# Altium schematic sheet A3_plants.SchDoc
size 365 x 198 mm; SheetNumber: 3; SheetTotal: 6
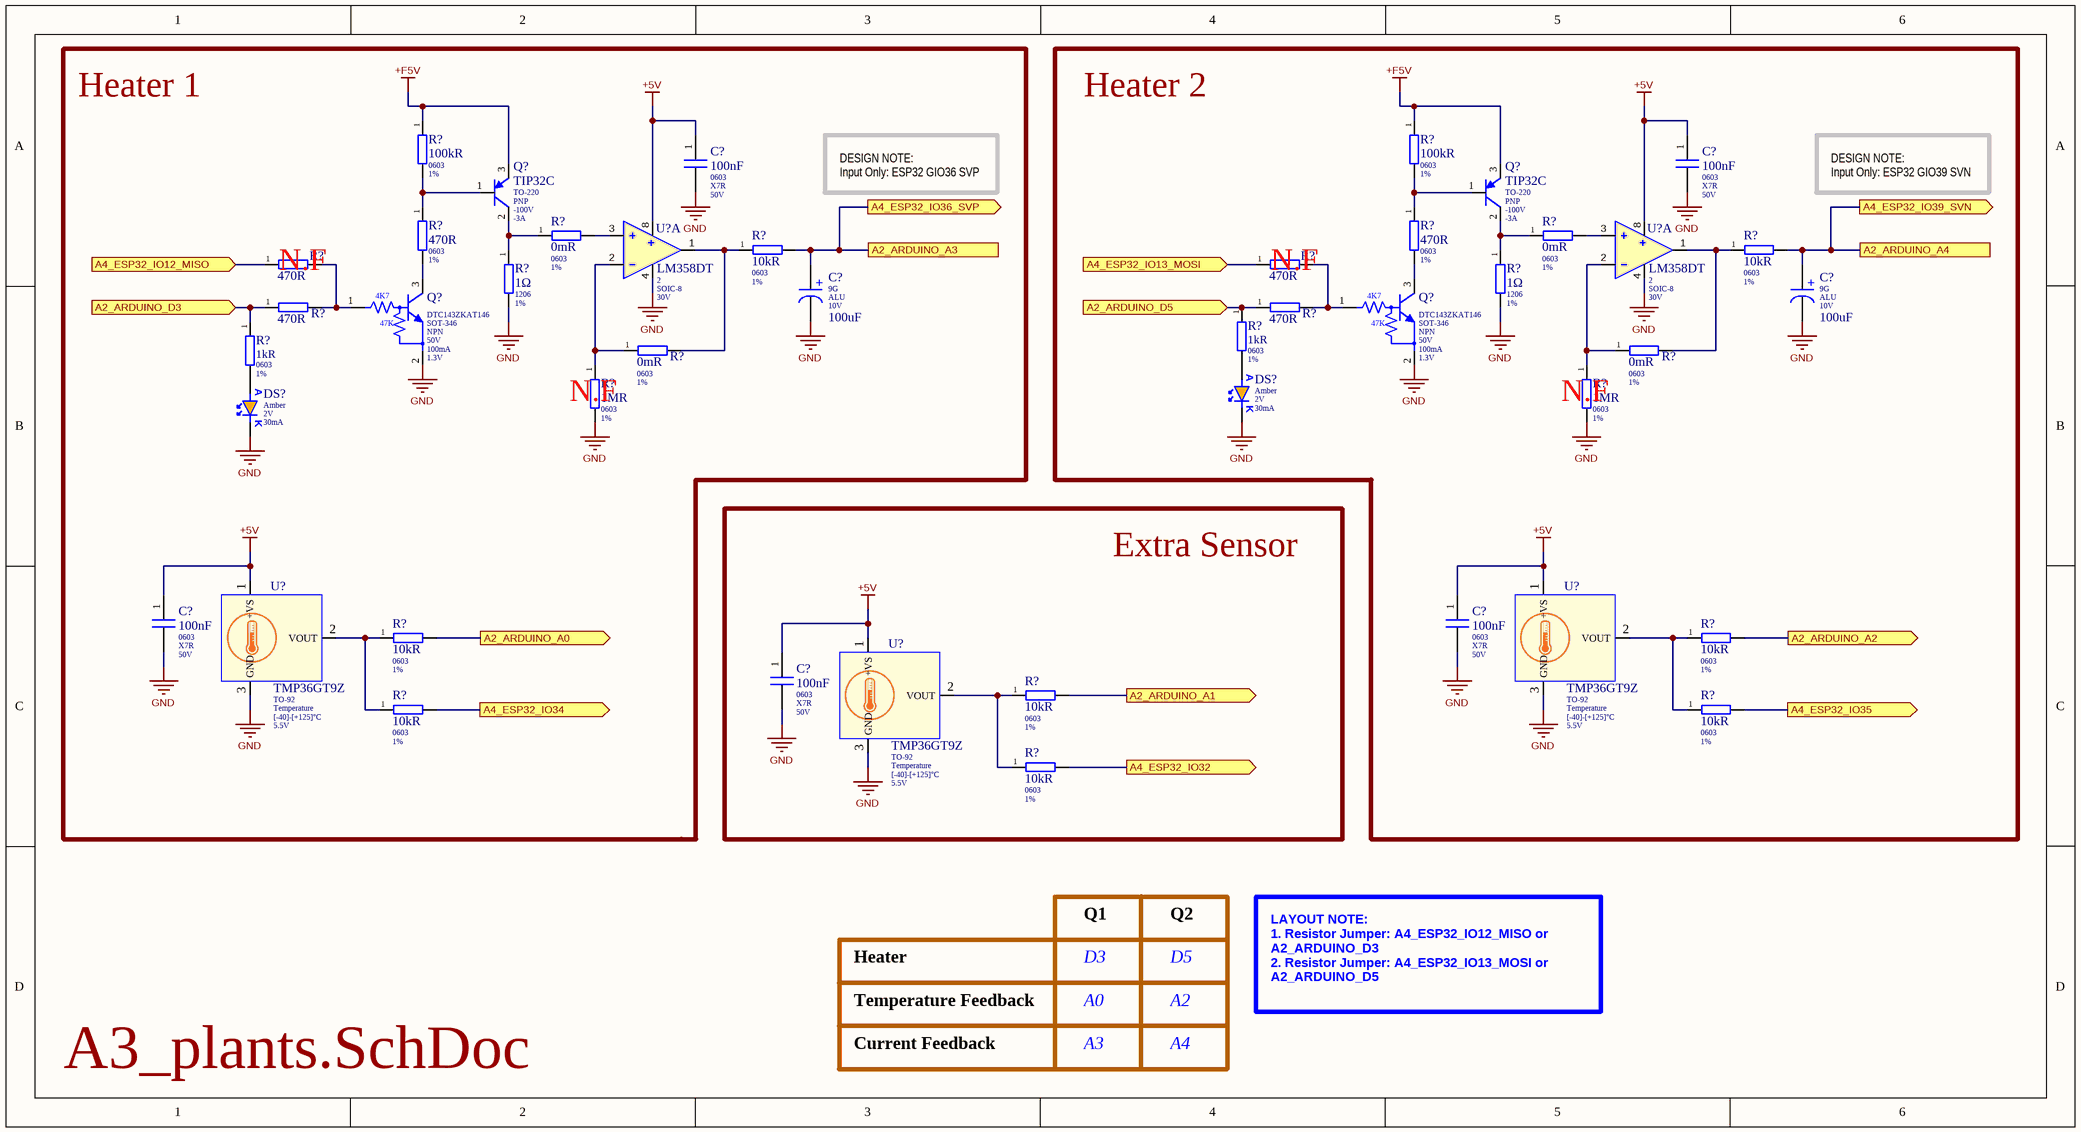
[diagram p0: A3_plants.SchDoc]

## Parts
(Parts that share a designator on the sheet are numbered #1, #2 ... from top to bottom, then left to right.)
C?#1  Capacitance: 100nF  Case/Package: 0603  Dielectric: X7R  Voltage Rating (DC): 50V  [CAPC1608X09N]  (hidden comment: CAP-CER_100n_50V_20%_X7R_0603)
C?#2  Capacitance: 100nF  Case/Package: 0603  Dielectric: X7R  Voltage Rating (DC): 50V  [CAPC1608X09N]  (hidden comment: CAP-CER_100n_50V_20%_X7R_0603)
C?#3  _Case Size: 9G  _Type: ALU  Voltage Rating: 10V  Capacitance: 100uF  [CAPAE7866X56M]  (hidden comment: CAP-ALU_100uF_10V_20%_9G/SMD)
C?#4  _Case Size: 9G  _Type: ALU  Voltage Rating: 10V  Capacitance: 100uF  [CAPAE7866X56M]  (hidden comment: CAP-ALU_100uF_10V_20%_9G/SMD)
C?#5  Capacitance: 100nF  Case/Package: 0603  Dielectric: X7R  Voltage Rating (DC): 50V  [CAPC1608X09N]  (hidden comment: CAP-CER_100n_50V_20%_X7R_0603)
C?#6  Capacitance: 100nF  Case/Package: 0603  Dielectric: X7R  Voltage Rating (DC): 50V  [CAPC1608X09N]  (hidden comment: CAP-CER_100n_50V_20%_X7R_0603)
C?#7  Capacitance: 100nF  Case/Package: 0603  Dielectric: X7R  Voltage Rating (DC): 50V  [CAPC1608X09N]  (hidden comment: CAP-CER_100n_50V_20%_X7R_0603)
DS?#1  _Color: Amber  _Forward_Voltage: 2V  _Forward_Current: 30mA  [LEDC1608X08N_A]  (hidden comment: LED_amber_2V_30mA_0603)
DS?#2  _Color: Amber  _Forward_Voltage: 2V  _Forward_Current: 30mA  [LEDC1608X08N_A]  (hidden comment: LED_amber_2V_30mA_0603)
Q?#1  MFG PN: TIP32C  Case/Package: TO-220  Polarity: PNP  Voltage Rating (DC): -100V  Current Rating: -3A  [TO255P1040X460X1968-3P_ST_HS191x132x95]  (hidden comment: TRNS-PNP_(-100V)_3A_TO-220)
Q?#2  MFG PN: TIP32C  Case/Package: TO-220  Polarity: PNP  Voltage Rating (DC): -100V  Current Rating: -3A  [TO255P1040X460X1968-3P_ST_HS191x132x95]  (hidden comment: TRNS-PNP_(-100V)_3A_TO-220)
Q?#3  MFG PN: DTC143ZKAT146  Case/Package: SOT-346  Polarity: NPN  Voltage Rating (DC): 50V  Continuous Collector Current: 100mA  Input Voltage: 1.3V  [ROHM_DTC143ZKAT146]  (hidden comment: DIGTTRAN-NPN_50V_100mA_1.3V_SOT-346)
Q?#4  MFG PN: DTC143ZKAT146  Case/Package: SOT-346  Polarity: NPN  Voltage Rating (DC): 50V  Continuous Collector Current: 100mA  Input Voltage: 1.3V  [ROHM_DTC143ZKAT146]  (hidden comment: DIGTTRAN-NPN_50V_100mA_1.3V_SOT-346)
R?#1  Resistance: 100kR  Case Code (Imperial): 0603  Tolerance: 1%  [RESC1608X06N]  (hidden comment: RES_100K_100mW_1%_0603)
R?#2  Resistance: 100kR  Case Code (Imperial): 0603  Tolerance: 1%  [RESC1608X06N]  (hidden comment: RES_100K_100mW_1%_0603)
R?#3  value 470R  Case/Package: 0603  Tolerance: 1%  [RESC1608X06N]  (hidden comment: RES_470R_100mW_1%_0603)
R?#4  value 470R  Case/Package: 0603  Tolerance: 1%  [RESC1608X06N]  (hidden comment: RES_470R_100mW_1%_0603)
R?#5  Resistance: 0mR  Case/Package: 0603  Tolerance: 1%  [RESC1608X06N]  (hidden comment: RES_0R_100mW_1%_0603)
R?#6  Resistance: 0mR  Case/Package: 0603  Tolerance: 1%  [RESC1608X06N]  (hidden comment: RES_0R_100mW_1%_0603)
R?#7  value 1Ω  Case/Package: 1206  Tolerance: 1%  [RESC3216X06N]  (hidden comment: RES_1R_250mW_1%_1206)
R?#8  Resistance: 10kR  Case/Package: 0603  Tolerance: 1%  [RESC1608X06N]  (hidden comment: RES_10K_100mW_1%_0603)
R?#9  value 1Ω  Case/Package: 1206  Tolerance: 1%  [RESC3216X06N]  (hidden comment: RES_1R_250mW_1%_1206)
R?#10  Resistance: 10kR  Case/Package: 0603  Tolerance: 1%  [RESC1608X06N]  (hidden comment: RES_10K_100mW_1%_0603)
R?#11  value 470R  [RESC1608X06N]  (hidden comment: RES_470R_100mW_1%_0603)
R?#12  value 470R  [RESC1608X06N]  (hidden comment: RES_470R_100mW_1%_0603)
R?#13  value 470R  [RESC1608X06N]  (hidden comment: RES_470R_100mW_1%_0603)
R?#14  Resistance: 1kR  Case/Package: 0603  Tolerance: 1%  [RESC1608X06N]  (hidden comment: RES_1K_100mW_1%_0603)
R?#15  value 470R  [RESC1608X06N]  (hidden comment: RES_470R_100mW_1%_0603)
R?#16  Resistance: 1kR  Case/Package: 0603  Tolerance: 1%  [RESC1608X06N]  (hidden comment: RES_1K_100mW_1%_0603)
R?#17  Resistance: 0mR  Case/Package: 0603  Tolerance: 1%  [RESC1608X06N]  (hidden comment: RES_0R_100mW_1%_0603)
R?#18  Resistance: 0mR  Case/Package: 0603  Tolerance: 1%  [RESC1608X06N]  (hidden comment: RES_0R_100mW_1%_0603)
R?#19  value 1MR  Case Code (Imperial): 0603  Tolerance: 1%  [RESC1608X06N]  (hidden comment: RES_1M_100mW_1%_0603)
R?#20  value 1MR  Case Code (Imperial): 0603  Tolerance: 1%  [RESC1608X06N]  (hidden comment: RES_1M_100mW_1%_0603)
R?#21  Resistance: 10kR  Case/Package: 0603  Tolerance: 1%  [RESC1608X06N]  (hidden comment: RES_10K_100mW_1%_0603)
R?#22  Resistance: 10kR  Case/Package: 0603  Tolerance: 1%  [RESC1608X06N]  (hidden comment: RES_10K_100mW_1%_0603)
R?#23  Resistance: 10kR  Case/Package: 0603  Tolerance: 1%  [RESC1608X06N]  (hidden comment: RES_10K_100mW_1%_0603)
R?#24  Resistance: 10kR  Case/Package: 0603  Tolerance: 1%  [RESC1608X06N]  (hidden comment: RES_10K_100mW_1%_0603)
R?#25  Resistance: 10kR  Case/Package: 0603  Tolerance: 1%  [RESC1608X06N]  (hidden comment: RES_10K_100mW_1%_0603)
R?#26  Resistance: 10kR  Case/Package: 0603  Tolerance: 1%  [RESC1608X06N]  (hidden comment: RES_10K_100mW_1%_0603)
U?#1  MFG PN: LM358DT  Number of Circuits: 2  Case/Package: SOIC-8  Max Supply Voltage: 30V  [SOIC127P600X175-8N]  (hidden comment: OPAMP_2_30V_7mV_1.1MHz_SOIC-8)  (part A of 2)
U?#2  MFG PN: LM358DT  Number of Circuits: 2  Case/Package: SOIC-8  Max Supply Voltage: 30V  [SOIC127P600X175-8N]  (hidden comment: OPAMP_2_30V_7mV_1.1MHz_SOIC-8)  (part A of 2)
U?#3  MFG PN: TMP36GT9Z  Case/Package: TO-92  Type: Temperature  Temp. Range: [-40]-[+125]°C  Max Supply Voltage: 5.5V  [XDCR_TMP36GT9]  (hidden comment: XDCR_Temp_(-40)-125C_2.7-5.5V_TO-92)
U?#4  MFG PN: TMP36GT9Z  Case/Package: TO-92  Type: Temperature  Temp. Range: [-40]-[+125]°C  Max Supply Voltage: 5.5V  [XDCR_TMP36GT9]  (hidden comment: XDCR_Temp_(-40)-125C_2.7-5.5V_TO-92)
U?#5  MFG PN: TMP36GT9Z  Case/Package: TO-92  Type: Temperature  Temp. Range: [-40]-[+125]°C  Max Supply Voltage: 5.5V  [XDCR_TMP36GT9]  (hidden comment: XDCR_Temp_(-40)-125C_2.7-5.5V_TO-92)

## Blocks framed on the sheet
Heater 2: C?#2 C?#4 C?#6 DS?#1 Q?#2 Q?#4 R?#2 R?#4 R?#6 R?#9 R?#10 R?#12 R?#14 R?#15 R?#18 R?#20 R?#22 R?#25 U?#2 U?#4
Extra Sensor: C?#7 R?#23 R?#26 U?#5

## Ports
A2_ARDUINO_A0 (out), A2_ARDUINO_A1 (out), A2_ARDUINO_A2 (out), A2_ARDUINO_A3 (out), A2_ARDUINO_A4 (out), A2_ARDUINO_D3 (in), A2_ARDUINO_D5 (in), A4_ESP32_IO12_MISO (in), A4_ESP32_IO13_MOSI (in), A4_ESP32_IO32 (out), A4_ESP32_IO34 (out), A4_ESP32_IO35 (out), A4_ESP32_IO36_SVP (out), A4_ESP32_IO39_SVN (out)

## Nets
+5V: C?#1.1 C?#2.1 C?#5.1 C?#6.1 C?#7.1 U?#1.8(VCC+) U?#2.8(VCC+) U?#3.1(+VS) U?#4.1(+VS) U?#5.1(+VS)
+F5V: Q?#1.3(E) Q?#2.3(E) R?#1.1 R?#2.1
GND: C?#1.2 C?#2.2 C?#3.2(Negative) C?#4.2(Negative) C?#5.2 C?#6.2 C?#7.2 DS?#1.2(K) DS?#2.2(K) Q?#3.2(E) Q?#4.2(E) R?#7.2 R?#9.2 R?#19.2 R?#20.2 U?#1.4(VCC-) U?#2.4(VCC-) U?#3.3(GND) U?#4.3(GND) U?#5.3(GND)
A2_ARDUINO_A0: R?#21.2 ; port A2_ARDUINO_A0
A2_ARDUINO_A1: R?#23.2 ; port A2_ARDUINO_A1
A2_ARDUINO_A2: R?#22.2 ; port A2_ARDUINO_A2
A2_ARDUINO_D3: R?#13.1 R?#16.1 ; port A2_ARDUINO_D3
A2_ARDUINO_D5: R?#14.1 R?#15.1 ; port A2_ARDUINO_D5
A4_ESP32_IO12_MISO: R?#11.1 ; port A4_ESP32_IO12_MISO
A4_ESP32_IO13_MOSI: R?#12.1 ; port A4_ESP32_IO13_MOSI
A4_ESP32_IO32: R?#26.2 ; port A4_ESP32_IO32
A4_ESP32_IO34: R?#24.2 ; port A4_ESP32_IO34
A4_ESP32_IO35: R?#25.2 ; port A4_ESP32_IO35
A4_ESP32_IO36_SVP: C?#3.1(Positive) R?#8.2 ; port A4_ESP32_IO36_SVP
A4_ESP32_IO39_SVN: C?#4.1(Positive) R?#10.2 ; port A4_ESP32_IO39_SVN
NetDS?#1_1: DS?#1.1(A) R?#14.2
NetDS?#2_1: DS?#2.1(A) R?#16.2
NetQ?#1_1: Q?#1.1(B) R?#1.2 R?#3.1
NetQ?#1_2: Q?#1.2(C) R?#5.1 R?#7.1
NetQ?#2_1: Q?#2.1(B) R?#2.2 R?#4.1
NetQ?#2_2: Q?#2.2(C) R?#6.1 R?#9.1
NetQ?#3_1: Q?#3.1(B) R?#11.2 R?#13.2
NetQ?#3_3: Q?#3.3(C) R?#3.2
NetQ?#4_1: Q?#4.1(B) R?#12.2 R?#15.2
NetQ?#4_3: Q?#4.3(C) R?#4.2
NetR?#5_2: R?#5.2 U?#1.3(IN1+)
NetR?#6_2: R?#6.2 U?#2.3(IN1+)
NetR?#8_1: R?#8.1 R?#17.2 U?#1.1(OUT1)
NetR?#10_1: R?#10.1 R?#18.2 U?#2.1(OUT1)
NetR?#17_1: R?#17.1 R?#19.1 U?#1.2(IN1-)
NetR?#18_1: R?#18.1 R?#20.1 U?#2.2(IN1-)
NetR?#21_1: R?#21.1 R?#24.1 U?#3.2(VOUT)
NetR?#22_1: R?#22.1 R?#25.1 U?#4.2(VOUT)
NetR?#23_1: R?#23.1 R?#26.1 U?#5.2(VOUT)

## Notes on the sheet
- Heater 1
- DESIGN NOTE:
  Input Only: ESP32 GIO36 SVP
- DESIGN NOTE:
  Input Only: ESP32 GIO39 SVN
- (near R?#11) N.F
- (near R?#12) N.F
- (near R?#19) N.F
- (near R?#20) N.F
- Q1
- Q2
- Heater
- Temperature Feedback
- D3
- A0
- D5
- A2
- LAYOUT NOTE:
  1. Resistor Jumper: A4_ESP32_IO12_MISO or A2_ARDUINO_D3
  2. Resistor Jumper: A4_ESP32_IO13_MOSI or A2_ARDUINO_D5
- Current Feedback
- A3
- A4
- (in symbol Kemet_EDK107M010A9GAA) +
- (in symbol ROHM_DTC143ZKAT146) 4K7; 47K

## Library data of the parts
C?#1 C?#2 C?#5-C?#7 = Kemet_C0603C104M5RAC: MFG: KEMET; Dielectric Material: Ceramic; Tolerance: 20%; _Checked_PCB: HoP; Supplier 1: Mouser; MFG PN: C0603C104M5RAC; RoHS: Yes; Category: Ceramic Capacitors; Stock 1: 461921; Pricing 1: 1=0.1, 10=0.033, 50=0.033, 100=0.015, 1000=0.009, 10000=0.006 (USD); Mount: Surface Mount; Case Code (Imperial): 0603; Case Code (Metric): 1608; Min Operating Temperature: -55°C; Max Operating Temperature: 125°C; Packaging: Tape and Reel; Package Quantity: 4000; Termination: SMD/SMT; Series: C0603C; Construction: Flat; Length: 1.6mm; Width: 0.8mm; RoHS Compliant: Yes; ComponentLink1URL: http://www.mouser.com/ds/2/212/KEM_C1002_X7R_SMD-1102033.pdf?src-supplier=Mouser; ComponentLink1Description: http://www.mouser.com/ds/2/212/KEM_C1002_X7R_SMD-1102033.pdf?src-supplier=Mouser; Supplier Part Number 1: 80-C0603C104M5RAC; _Checked_SCH: HoP; _Creator: HoP; _SYM_REF: CAP-CER_100n_50V_20%_X7R_0603
C?#3 C?#4 = Kemet_EDK107M010A9GAA: MFG: KEMET; Tolerance: 20%; Ripple Current: 70mA; Life (Hours): 2000Hour; _Checked_PCB: HoP; Supplier 1: Mouser; MFG PN: EDK107M010A9GAA; RoHS: Yes; Category: Aluminum Electrolytic Capacitors; Stock 1: 3002; Pricing 1: 1=0.36, 10=0.248, 50=0.174, 100=0.149, 1000=0.094, 10000=0.089 (USD); Mount: Surface Mount; Case/Package: Radial; Min Operating Temperature: -40°C; Max Operating Temperature: 85°C; Ripple Current (AC): 70mA; Packaging: Cut Tape; Voltage Rating (DC): 10V; Series: EDK; Diameter: 6.3mm; Height: 5.4mm; Radiation Hardening: No; Reach SVHC Compliant: No; RoHS Compliant: Yes; ComponentLink1URL: https://datasheet.ciiva.com/8032/1680956-8032470.pdf?src-supplier=Element14; ComponentLink1Description: https://datasheet.ciiva.com/8032/1680956-8032470.pdf?src-supplier=Element14; Supplier Part Number 1: 80-EDK107M010A9GAA; _Checked_SCH: HoP; _Creator: HoP; _SYM_REF: CAP-ALU_100uF_10V_20%_9G/SMD
DS?#1 DS?#2 = WURTH_150060AS75000: MFG: Wurth Electronics; _Checked_PCB: HoP; Supplier 1: Mouser; MFG PN: 150060AS75000; RoHS: Yes; Category: LEDs; Stock 1: 55612; Pricing 1: 1=0.15, 10=0.149, 50=0.142, 100=0.122, 1000=0.105, 10000=0.105 (USD); RoHS Compliant: Yes; ComponentLink1URL: http://www.farnell.com/datasheets/2621639.pdf?src-supplier=Farnell; ComponentLink1Description: http://www.farnell.com/datasheets/2621639.pdf?src-supplier=Farnell; ComponentLink2URL: http://www.farnell.com/datasheets/2621639.pdf?src-supplier=Newark; ComponentLink2Description: http://www.farnell.com/datasheets/2621639.pdf?src-supplier=Newark; ComponentLink3URL: http://www.farnell.com/datasheets/2621639.pdf?src-supplier=Element14; ComponentLink3Description: http://www.farnell.com/datasheets/2621639.pdf?src-supplier=Element14; Supplier Part Number 1: 710-150060AS75000; _Checked_SCH: HoP; _Creator: HoP; _SYM_REF: LED_amber_2V_30mA_0603
Q?#1 Q?#2 = ST_TIP32C: MFG: STMicroelectronics; Collector Emitter Breakdown Voltage: 100V; Collector Emitter Saturation Voltage: 1.2V; Element Configuration: Single; Emitter Base Voltage (VEBO): -5V; Gain Bandwidth Product: 3MHz; hFE Min: 10; Max Collector Current: 3A; Max Junction Temperature (Tj): 150°C; Max Power Dissipation: 40W; Number of Elements: 1; _Checked_PCB: N.A; _Checked_SCH: HoP; Supplier: DigiKey; Supplier Part Number: 497-2628-5-ND; RoHS: Compliant; Category: BJTs; Stock: 4385; Pricing: 1=0.99, 50=0.4572, 100=0.4044, 500=0.31156, 1000=0.28165, 2000=0.25648, 5000=0.22923, 10000=0.21238, 50000=0.19875 (USD); China RoHS: Non-Compliant; Collector Base Voltage (VCBO): -100V; Collector Emitter Voltage (VCEO): 100V; Height: 19.68mm; Length: 10.4mm; Lifecycle Status: Production; Max Operating Temperature: 150°C; Min Operating Temperature: -65°C; Mounting Technology: Through Hole; Pins: 3; Number of Terminals: 3; Power Dissipation: 40W; Radiation Hardening: No; REACH SVHC: No; Schedule B: 8541290080; Transition Frequency: 3MHz; Weight: 4.535924g; Width: 4.6mm; ComponentLink1URL: https://datasheet.octopart.com:443/TIP32C-STMicroelectronics-datasheet-8098357.pdf?src-supplier=Arrow+Electronics; ComponentLink1Description: https://datasheet.octopart.com:443/TIP32C-STMicroelectronics-datasheet-8098357.pdf?src-supplier=Arrow+Electronics; ComponentLink2URL: https://datasheet.octopart.com:443/TIP32C-STMicroelectronics-datasheet-12525884.pdf?src-supplier=TME; ComponentLink2Description: https://datasheet.octopart.com:443/TIP32C-STMicroelectronics-datasheet-12525884.pdf?src-supplier=TME; ComponentLink3URL: https://datasheet.octopart.com:443/TIP32C-STMicroelectronics-datasheet-62337654.pdf?src-supplier=Farnell; ComponentLink3Description: https://datasheet.octopart.com:443/TIP32C-STMicroelectronics-datasheet-62337654.pdf?src-supplier=Farnell; ComponentLink4URL: https://datasheet.octopart.com:443/TIP32C-STMicroelectronics-datasheet-9639817.pdf?src-supplier=RS+(Formerly+Allied+Electronics); ComponentLink4Description: https://datasheet.octopart.com:443/TIP32C-STMicroelectronics-datasheet-9639817.pdf?src-supplier=RS+(Formerly+Allied+Electronics); ComponentLink5URL: https://datasheet.octopart.com:443/TIP32C-STMicroelectronics-datasheet-6387301.pdf?src-supplier=element14; ComponentLink5Description: https://datasheet.octopart.com:443/TIP32C-STMicroelectronics-datasheet-6387301.pdf?src-supplier=element14; ComponentLink6URL: https://datasheet.octopart.com:443/TIP32C-STMicroelectronics-datasheet-109740.pdf?src-supplier=Nu+Horizons; ComponentLink6Description: https://datasheet.octopart.com:443/TIP32C-STMicroelectronics-datasheet-109740.pdf?src-supplier=Nu+Horizons; ComponentLink7URL: https://datasheet.octopart.com:443/TIP32C-STMicroelectronics-datasheet-56742.pdf?src-supplier=Newark; ComponentLink7Description: https://datasheet.octopart.com:443/TIP32C-STMicroelectronics-datasheet-56742.pdf?src-supplier=Newark; ComponentLink8URL: https://datasheet.octopart.com:443/TIP32C-STMicroelectronics-datasheet-101609.pdf?src-supplier=B%2bD+Enterprises; ComponentLink8Description: https://datasheet.octopart.com:443/TIP32C-STMicroelectronics-datasheet-101609.pdf?src-supplier=B%2bD+Enterprises; ComponentLink9URL: https://datasheet.octopart.com:443/TIP32C-STMicroelectronics-datasheet-74906.pdf?src-supplier=DigiKey; ComponentLink9Description: https://datasheet.octopart.com:443/TIP32C-STMicroelectronics-datasheet-74906.pdf?src-supplier=DigiKey; _Creator: HoP; _SYM_REF: TRNS-PNP_(-100V)_3A_TO-220
Q?#3 Q?#4 = ROHM_DTC143ZKAT146: MFG: ROHM; Collector Emitter Saturation Voltage: 300mV; Element Configuration: Single; hFE Min: 80; Max Power Dissipation: 200mW; Number of Elements: 1; Transition Frequency: 250MHz; _Checked_PCB: N.A; _Checked_SCH: HoP; Supplier: DigiKey; Supplier Part Number: DTC143ZKAT146CT-ND; RoHS: Compliant; Category: BJTs; Stock: 36801; Pricing: 1=0.22, 10=0.134, 100=0.0828, 500=0.06052, 1000=0.05329 (USD); Collector Emitter Breakdown Voltage: 50V; Collector Emitter Voltage (VCEO): 50V; Current Rating: 100mA; Height: 1.1mm; Lead Free: Lead Free; Length: 2.9mm; Lifecycle Status: Production; Max Breakdown Voltage: 50V; Max Collector Current: 100mA; Max Operating Temperature: 150°C; Max Output current: 100mA; Min Operating Temperature: -55°C; Pins: 3; Number of Terminals: 3; Operating Supply Voltage: 50V; Power Dissipation: 200mW; Radiation Hardening: No; REACH SVHC: Yes; Termination: SMD/SMT; Width: 1.6mm; ComponentLink1URL: https://datasheet.octopart.com:443/DTC143ZKAT146-ROHM-datasheet-181220973.pdf?src-supplier=IHS; ComponentLink1Description: https://datasheet.octopart.com:443/DTC143ZKAT146-ROHM-datasheet-181220973.pdf?src-supplier=IHS; ComponentLink2URL: https://datasheet.octopart.com:443/DTC143ZKAT146-Rohm-datasheet-12520273.pdf?src-supplier=Newark; ComponentLink2Description: https://datasheet.octopart.com:443/DTC143ZKAT146-Rohm-datasheet-12520273.pdf?src-supplier=Newark; ComponentLink3URL: https://datasheet.octopart.com:443/DTC143ZKAT146-Rohm-datasheet-7554225.pdf?src-supplier=Newark; ComponentLink3Description: https://datasheet.octopart.com:443/DTC143ZKAT146-Rohm-datasheet-7554225.pdf?src-supplier=Newark; ComponentLink4URL: https://datasheet.octopart.com:443/DTC143ZKAT146-Rohm-datasheet-517315.pdf?src-supplier=Newark; ComponentLink4Description: https://datasheet.octopart.com:443/DTC143ZKAT146-Rohm-datasheet-517315.pdf?src-supplier=Newark; ComponentLink5URL: https://datasheet.octopart.com:443/DTC143ZKAT146-Rohm-datasheet-83037998.pdf?src-supplier=Newark; ComponentLink5Description: https://datasheet.octopart.com:443/DTC143ZKAT146-Rohm-datasheet-83037998.pdf?src-supplier=Newark; ComponentLink6URL: https://datasheet.octopart.com:443/DTC143ZKAT146-Rohm-datasheet-61209957.pdf?src-supplier=Newark; ComponentLink6Description: https://datasheet.octopart.com:443/DTC143ZKAT146-Rohm-datasheet-61209957.pdf?src-supplier=Newark; ComponentLink7URL: https://datasheet.octopart.com:443/DTC143ZKAT146-ROHM-datasheet-179660690.pdf?src-supplier=Future+Electronics; ComponentLink7Description: https://datasheet.octopart.com:443/DTC143ZKAT146-ROHM-datasheet-179660690.pdf?src-supplier=Future+Electronics; ComponentLink8URL: https://datasheet.octopart.com:443/DTC143ZKAT146-Rohm-datasheet-79626554.pdf?src-supplier=Future+Electronics; ComponentLink8Description: https://datasheet.octopart.com:443/DTC143ZKAT146-Rohm-datasheet-79626554.pdf?src-supplier=Future+Electronics; ComponentLink9URL: https://datasheet.octopart.com:443/DTC143ZKAT146-Rohm-datasheet-62073654.pdf?src-supplier=element14+APAC; ComponentLink9Description: https://datasheet.octopart.com:443/DTC143ZKAT146-Rohm-datasheet-62073654.pdf?src-supplier=element14+APAC; ComponentLink10URL: https://datasheet.octopart.com:443/DTC143ZKAT146-Rohm-datasheet-142142663.pdf?src-supplier=Rohm+SCT; ComponentLink10Description: https://datasheet.octopart.com:443/DTC143ZKAT146-Rohm-datasheet-142142663.pdf?src-supplier=Rohm+SCT; ComponentLink11URL: https://datasheet.octopart.com:443/DTC143ZKAT146-Rohm-datasheet-21214123.pdf?src-supplier=RS+(Formerly+Allied+Electronics); ComponentLink11Description: https://datasheet.octopart.com:443/DTC143ZKAT146-Rohm-datasheet-21214123.pdf?src-supplier=RS+(Formerly+Allied+Electronics); ComponentLink12URL: https://datasheet.octopart.com:443/DTC143ZKAT146-Rohm-datasheet-6397579.pdf?src-supplier=Farnell; ComponentLink12Description: https://datasheet.octopart.com:443/DTC143ZKAT146-Rohm-datasheet-6397579.pdf?src-supplier=Farnell; ComponentLink13URL: https://datasheet.octopart.com:443/DTC143ZKAT146-Rohm-datasheet-7539021.pdf?src-supplier=Farnell; ComponentLink13Description: https://datasheet.octopart.com:443/DTC143ZKAT146-Rohm-datasheet-7539021.pdf?src-supplier=Farnell; ComponentLink14URL: https://datasheet.octopart.com:443/DTC143ZKAT146-Rohm-datasheet-6397127.pdf?src-supplier=Farnell; ComponentLink14Description: https://datasheet.octopart.com:443/DTC143ZKAT146-Rohm-datasheet-6397127.pdf?src-supplier=Farnell; ComponentLink15URL: https://datasheet.octopart.com:443/DTC143ZKAT146-Rohm-datasheet-7549687.pdf?src-supplier=Farnell; ComponentLink15Description: https://datasheet.octopart.com:443/DTC143ZKAT146-Rohm-datasheet-7549687.pdf?src-supplier=Farnell; ComponentLink16URL: https://datasheet.octopart.com:443/DTC143ZKAT146-Rohm-datasheet-6399918.pdf?src-supplier=Farnell; ComponentLink16Description: https://datasheet.octopart.com:443/DTC143ZKAT146-Rohm-datasheet-6399918.pdf?src-supplier=Farnell; ComponentLink17URL: https://datasheet.octopart.com:443/DTC143ZKAT146-Rohm-datasheet-6397200.pdf?src-supplier=Farnell; ComponentLink17Description: https://datasheet.octopart.com:443/DTC143ZKAT146-Rohm-datasheet-6397200.pdf?src-supplier=Farnell; ComponentLink18URL: https://datasheet.octopart.com:443/DTC143ZKAT146-Rohm-datasheet-8127158.pdf?src-supplier=Farnell; ComponentLink18Description: https://datasheet.octopart.com:443/DTC143ZKAT146-Rohm-datasheet-8127158.pdf?src-supplier=Farnell; ComponentLink19URL: https://datasheet.octopart.com:443/DTC143ZKAT146-Rohm-datasheet-14065402.pdf?src-supplier=iiiC; ComponentLink19Description: https://datasheet.octopart.com:443/DTC143ZKAT146-Rohm-datasheet-14065402.pdf?src-supplier=iiiC; ComponentLink20URL: https://datasheet.octopart.com:443/DTC143ZKAT146-Rohm-datasheet-30944.pdf?src-supplier=DigiKey; ComponentLink20Description: https://datasheet.octopart.com:443/DTC143ZKAT146-Rohm-datasheet-30944.pdf?src-supplier=DigiKey; _Creator: HoP; _SYM_REF: DIGTTRAN-NPN_50V_100mA_1.3V_SOT-346; Mounting Technology: Surface Mount
R?#1 R?#2 = Yageo_RC0603FR-07100KL: MFG: Yageo; Temperature Coefficient: 100ppm/°C; Max Power Dissipation: 100mW; Voltage Rating: 50V; _Creator: HoP; _Value: 100000; Supplier 1: Mouser; MFG PN: RC0603FR-07100KL; RoHS: Yes; Category: Chip SMD Resistors; Stock 1: 5127875; Pricing 1: 1=0.1, 10=0.017, 50=0.017, 100=0.008, 1000=0.004, 10000=0.004 (USD); Case/Package: 0603; Number of Pins: 2; Case Code (Metric): 1608; Min Operating Temperature: -55°C; Max Operating Temperature: 155°C; Packaging: Tape and Reel; Series: RC; Number of Terminations: 2; Power Rating: 100mW; Features: Moisture Resistant; Termination: SMD/SMT; Voltage Rating (DC): 50V; Resistance Tolerance: 1%; Resistor Type: Thick Film; Construction: Rectangular; Technology: THICK FILM; Length: 1.6mm; Width: 0.8mm; Height: 0.45mm; Depth: 0.8mm; RoHS Compliant: Yes; Lead Free: Lead Free; Reach SVHC Compliant: No; Military Standard: Not; ComponentLink1URL: https://datasheet.ciiva.com/11808/0900766b80f96399-11808107.pdf?src-supplier=Rs; ComponentLink1Description: https://datasheet.ciiva.com/11808/0900766b80f96399-11808107.pdf?src-supplier=Rs; ComponentLink2URL: https://datasheet.ciiva.com/7983/443971-7983593.pdf?src-supplier=Element14; ComponentLink2Description: https://datasheet.ciiva.com/7983/443971-7983593.pdf?src-supplier=Element14; ComponentLink3URL: https://datasheet.ciiva.com/22747/443971-22747516.pdf?src-supplier=Element14; ComponentLink3Description: https://datasheet.ciiva.com/22747/443971-22747516.pdf?src-supplier=Element14; ComponentLink4URL: https://datasheet.ciiva.com/46440/1868787-46440889.pdf?src-supplier=Element14; ComponentLink4Description: https://datasheet.ciiva.com/46440/1868787-46440889.pdf?src-supplier=Element14; ComponentLink5URL: https://datasheet.ciiva.com/7746/1738695-7746235.pdf?src-supplier=Element14; ComponentLink5Description: https://datasheet.ciiva.com/7746/1738695-7746235.pdf?src-supplier=Element14; ComponentLink6URL: https://datasheet.ciiva.com/7746/1738695-7746234.pdf?src-supplier=Element14; ComponentLink6Description: https://datasheet.ciiva.com/7746/1738695-7746234.pdf?src-supplier=Element14; Supplier Part Number 1: 603-RC0603FR-07100KL; _Checked_SCH: HoP; _Checked_PCB: HoP; _SYM_REF: RES_100K_100mW_1%_0603
R?#3 R?#4 = Yageo_RC0603FR-07470RL: MFG: Yageo; Power Rating: 100mW; Voltage Rating: 50V; Temperature Coefficient: 100ppm/°C; Working Voltage: 75V; Impedance: 50R; _Checked_PCB: N.A; _Checked_SCH: HoP; _Value: 470; Supplier: Mouser; Supplier Part Number: 603-RC0603FR-07470RL; MFG PN: RC0603FR-07470RL; RoHS: Yes; Category: Chip SMD Resistors; Stock: 209227; Pricing: 1=0.1, 10=0.008, 50=0.008, 100=0.007, 1000=0.006, 10000=0.002 (USD); Case Code (Metric): 1608; Case Code (Imperial): 0603; Contact Material: 152ConductorMaterial; Contact Plating: 157ConductorMaterial; Min Operating Temperature: -55°C; Max Operating Temperature: 155°C; Packaging: Tape and Reel; Number of Terminations: 2; Termination: SMD/SMT; Max Power Dissipation: 100mW; Features: Moisture Resistant; Package Quantity: 1; Resistor Type: Thick Film; Series: RC; Technology: THICK FILM; Length: 0.063inch; Width: 0.031inch; Height: 0.022inch; Depth: 0.8mm; Radiation Hardening: 5898YesNo; Reach SVHC Compliant: No; Lead Free: Lead Free; RoHS Compliant: Yes; ComponentLink1URL: https://datasheet.ciiva.com/11808/0900766b80f96399-11808177.pdf?src-supplier=Rs; ComponentLink1Description: https://datasheet.ciiva.com/11808/0900766b80f96399-11808177.pdf?src-supplier=Rs; ComponentLink2URL: https://datasheet.ciiva.com/7660/1868787-7660793.pdf?src-supplier=Element14; ComponentLink2Description: https://datasheet.ciiva.com/7660/1868787-7660793.pdf?src-supplier=Element14; ComponentLink3URL: https://datasheet.ciiva.com/46440/1868787-46440907.pdf?src-supplier=Element14; ComponentLink3Description: https://datasheet.ciiva.com/46440/1868787-46440907.pdf?src-supplier=Element14; ComponentLink4URL: https://datasheet.ciiva.com/2454/pyu-r-int-thick-7-2454013.pdf?src-supplier=Digikey; ComponentLink4Description: https://datasheet.ciiva.com/2454/pyu-r-int-thick-7-2454013.pdf?src-supplier=Digikey; ComponentLink5URL: https://datasheet.ciiva.com/2454/pyu-r-int-thick-7-2454014.pdf?src-supplier=Digikey; ComponentLink5Description: https://datasheet.ciiva.com/2454/pyu-r-int-thick-7-2454014.pdf?src-supplier=Digikey; ComponentLink6URL: https://datasheet.ciiva.com/2454/pyu-r-int-thick-7-2454012.pdf?src-supplier=Digikey; ComponentLink6Description: https://datasheet.ciiva.com/2454/pyu-r-int-thick-7-2454012.pdf?src-supplier=Digikey; ComponentLink7URL: https://datasheet.ciiva.com/7746/1738695-7746360.pdf?src-supplier=Element14; ComponentLink7Description: https://datasheet.ciiva.com/7746/1738695-7746360.pdf?src-supplier=Element14; ComponentLink8URL: https://datasheet.ciiva.com/7746/1738695-7746359.pdf?src-supplier=Element14; ComponentLink8Description: https://datasheet.ciiva.com/7746/1738695-7746359.pdf?src-supplier=Element14; _Creator: HoP; _SYM_REF: RES_470R_100mW_1%_0603; Resistance Tolerance: 1%
R?#5 R?#6 R?#17 R?#18 = Yageo_RC0603FR-070RL: MFG: Yageo; Power Rating: 100mW; Voltage Rating (DC): 50V; Temperature Coefficient: 200ppm/°C; _Checked_PCB: HoP; _Value: 0; Supplier 1: Mouser; MFG PN: RC0603FR-070RL; RoHS: Yes; Category: Chip SMD Resistors; Stock 1: 3348927; Pricing 1: 1=0.1, 10=0.01, 50=0.01, 100=0.005, 1000=0.004, 10000=0.003 (USD); Number of Pins: 2; Contact Plating: Tin,Matte; Case Code (Metric): 1608; Case Code (Imperial): 0603; Min Operating Temperature: -55°C; Max Operating Temperature: 155°C; Packaging: Tape and Reel; Resistor Type: Thick Film; Package Quantity: 5000; Voltage Rating: 50V; Number of Terminations: 2; Termination: SMD/SMT; Max Power Dissipation: 100mW; Features: Moisture Resistant; Series: RC; Construction: Rectangular; Resistance Tolerance: 1%; Technology: THICK FILM; Length: 1.6mm; Width: 0.8mm; Height: 0.45mm; Depth: 0.8mm; Reach SVHC Compliant: No; Lead Free: Lead Free; RoHS Compliant: Yes; Military Standard: Not; ComponentLink1URL: https://datasheet.ciiva.com/11808/0900766b80f96399-11808172.pdf?src-supplier=Rs; ComponentLink1Description: https://datasheet.ciiva.com/11808/0900766b80f96399-11808172.pdf?src-supplier=Rs; ComponentLink2URL: https://datasheet.ciiva.com/5684/443971-5684699.pdf?src-supplier=Farnell; ComponentLink2Description: https://datasheet.ciiva.com/5684/443971-5684699.pdf?src-supplier=Farnell; ComponentLink3URL: https://datasheet.ciiva.com/7983/443971-7983627.pdf?src-supplier=Element14; ComponentLink3Description: https://datasheet.ciiva.com/7983/443971-7983627.pdf?src-supplier=Element14; ComponentLink4URL: https://datasheet.ciiva.com/22643/1868787-22643388.pdf?src-supplier=Element14; ComponentLink4Description: https://datasheet.ciiva.com/22643/1868787-22643388.pdf?src-supplier=Element14; ComponentLink5URL: https://datasheet.ciiva.com/46382/443971-46382072.pdf?src-supplier=Element14; ComponentLink5Description: https://datasheet.ciiva.com/46382/443971-46382072.pdf?src-supplier=Element14; ComponentLink6URL: https://datasheet.ciiva.com/29721/pyu-r-int-thick-7-29721178.pdf?src-supplier=Digi-Key; ComponentLink6Description: https://datasheet.ciiva.com/29721/pyu-r-int-thick-7-29721178.pdf?src-supplier=Digi-Key; ComponentLink7URL: https://datasheet.ciiva.com/29721/pyu-rc0603-51-rohs-l-4-29721179.pdf?src-supplier=Digi-Key; ComponentLink7Description: https://datasheet.ciiva.com/29721/pyu-rc0603-51-rohs-l-4-29721179.pdf?src-supplier=Digi-Key; ComponentLink8URL: https://datasheet.ciiva.com/5558/rc0603-272842-5558341.pdf?src-supplier=Mouser; ComponentLink8Description: https://datasheet.ciiva.com/5558/rc0603-272842-5558341.pdf?src-supplier=Mouser; Supplier Part Number 1: 603-RC0603FR-070RL; _Checked_SCH: HoP; _Creator: HoP; _SYM_REF: RES_0R_100mW_1%_0603
R?#7 R?#9 = Yageo_RC1206FR-131RL: MFG: Yageo Group; Power Dissipation: 250mW; Temperature Coefficient: 200ppm/°C; Voltage Rating: 200V; _Checked_PCB: N.A; _Creator: HoP; _Value: 1; Supplier: DigiKey; Supplier Part Number: 13-RC1206FR-131RLCT-ND; MFG PN: RC1206FR-131RL; RoHS: Compliant; Category: Chip SMD Resistors; Stock: 16500; Pricing: 1=0.1, 10=0.045, 100=0.0337, 1000=0.02346, 2500=0.0153, 5000=0.01428 (USD); Case Code (Imperial): 1206; Case Code (Metric): 3216; China RoHS: Non-Compliant; Composition: Thick Film; Contact Plating: Tin; Depth: 1.6mm; Height: 550µm; Lead Free: Lead Free; Length: 3.1mm; Lifecycle Status: Production; Max Operating Temperature: 155°C; Military Standard: Not; Min Operating Temperature: -55°C; Mounting Technology: Surface Mount; Number of Terminals: 2; Power Rating: 250mW; Radiation Hardening: No; REACH SVHC: Yes; Termination: SMD/SMT; Width: 1.6mm; Working Voltage: 200V; ComponentLink1URL: https://datasheet.octopart.com:443/RC1206FR-131RL-Yageo-datasheet-175887523.pdf?src-supplier=Newark; ComponentLink1Description: https://datasheet.octopart.com:443/RC1206FR-131RL-Yageo-datasheet-175887523.pdf?src-supplier=Newark; ComponentLink2URL: https://datasheet.octopart.com:443/RC1206FR-131RL-Yageo-Group-datasheet-189192902.pdf?src-supplier=TME; ComponentLink2Description: https://datasheet.octopart.com:443/RC1206FR-131RL-Yageo-Group-datasheet-189192902.pdf?src-supplier=TME; ComponentLink3URL: https://datasheet.octopart.com:443/RC1206FR-131RL-Yageo-datasheet-164759695.pdf?src-supplier=Future+Electronics; ComponentLink3Description: https://datasheet.octopart.com:443/RC1206FR-131RL-Yageo-datasheet-164759695.pdf?src-supplier=Future+Electronics; ComponentLink4URL: https://datasheet.octopart.com:443/RC1206FR-131RL-Yageo-datasheet-137700087.pdf?src-supplier=Future+Electronics; ComponentLink4Description: https://datasheet.octopart.com:443/RC1206FR-131RL-Yageo-datasheet-137700087.pdf?src-supplier=Future+Electronics; ComponentLink5URL: https://datasheet.octopart.com:443/RC1206FR-131RL-Yageo-datasheet-13032847.pdf?src-supplier=Future+Electronics; ComponentLink5Description: https://datasheet.octopart.com:443/RC1206FR-131RL-Yageo-datasheet-13032847.pdf?src-supplier=Future+Electronics; ComponentLink6URL: https://datasheet.octopart.com/RC1206FR-131RL-Yageo-datasheet-73766026.pdf; ComponentLink6Description: https://datasheet.octopart.com/RC1206FR-131RL-Yageo-datasheet-73766026.pdf; ComponentLink7URL: http://sigma.octopart.com:80/rohs_statement/Yageo-company-2.pdf?src-supplier=Compliance+Statements; ComponentLink7Description: http://sigma.octopart.com:80/rohs_statement/Yageo-company-2.pdf?src-supplier=Compliance+Statements; ComponentLink8URL: http://sigma.octopart.com:80/conflict_mineral_statement/Yageo-company-3.pdf?src-supplier=Compliance+Statements; ComponentLink8Description: http://sigma.octopart.com:80/conflict_mineral_statement/Yageo-company-3.pdf?src-supplier=Compliance+Statements; _Checked_SCH: N.A; _SYM_REF: RES_1R_250mW_1%_1206
R?#8 R?#10 R?#21-R?#26 = Yageo_RC0603FR-0710KL: MFG: Yageo; Temperature Coefficient: 100ppm/°C; Voltage Rating (DC): 50V; Power Rating: 100mW; Voltage Rating: 75V; _Checked_PCB: HoP; _Checked_SCH: HoP_V1-1; _Value: 10000; Supplier 1: Mouser; MFG PN: RC0603FR-0710KL; RoHS: Yes; Category: Chip SMD Resistors; Stock 1: 13284125; Pricing 1: 1=0.1, 10=0.016, 50=0.016, 100=0.008, 1000=0.005, 10000=0.003 (USD); Number of Pins: 2; Case Code (Imperial): 0603; Case Code (Metric): 1608; Weight: 7.1E-05oz; Size Code: 0603; Min Operating Temperature: -55°C; Max Operating Temperature: 155°C; Resistor Type: Thick Film; Packaging: Tape and Reel; Termination: SMD/SMT; Features: Moisture Resistant; Series: RC; Max Power Dissipation: 100mW; Number of Terminations: 2; Resistance Tolerance: 1%; Construction: Rectangular; Length: 1.6mm; Width: 0.8mm; Height: 0.45mm; Depth: 0.8mm; Lead Pitch: 0.3mm; Reach SVHC Compliant: No; Lead Free: Lead Free; Military Standard: Not; RoHS Compliant: Yes; ComponentLink1URL: https://datasheet.ciiva.com/7660/38590-7660789.pdf?src-supplier=Element14; ComponentLink1Description: https://datasheet.ciiva.com/7660/38590-7660789.pdf?src-supplier=Element14; ComponentLink2URL: https://datasheet.ciiva.com/7983/443971-7983596.pdf?src-supplier=Element14; ComponentLink2Description: https://datasheet.ciiva.com/7983/443971-7983596.pdf?src-supplier=Element14; ComponentLink3URL: https://datasheet.ciiva.com/22747/443971-22747519.pdf?src-supplier=Element14; ComponentLink3Description: https://datasheet.ciiva.com/22747/443971-22747519.pdf?src-supplier=Element14; ComponentLink4URL: https://datasheet.ciiva.com/46440/1868787-46440891.pdf?src-supplier=Element14; ComponentLink4Description: https://datasheet.ciiva.com/46440/1868787-46440891.pdf?src-supplier=Element14; ComponentLink5URL: https://datasheet.ciiva.com/7746/1738695-7746239.pdf?src-supplier=Element14; ComponentLink5Description: https://datasheet.ciiva.com/7746/1738695-7746239.pdf?src-supplier=Element14; ComponentLink6URL: https://datasheet.ciiva.com/15189/getdatasheetpartid-409289-15189591.pdf?src-supplier=Verical; ComponentLink6Description: https://datasheet.ciiva.com/15189/getdatasheetpartid-409289-15189591.pdf?src-supplier=Verical; Supplier Part Number 1: 603-RC0603FR-0710KL; _Creator: HoP; _SYM_REF: RES_10K_100mW_1%_0603
R?#11-R?#13 R?#15 = Yageo_RC0603FR-07470RL: MFG: Yageo; Power Rating: 100mW; Voltage Rating: 50V; Temperature Coefficient: 100ppm/°C; Working Voltage: 75V; Impedance: 50R; _Checked_PCB: N.A; _Checked_SCH: HoP; _Value: 470; Resistance Tolerance: 1%; Supplier: Mouser; Supplier Part Number: 603-RC0603FR-07470RL; MFG PN: RC0603FR-07470RL; RoHS: Yes; Category: Chip SMD Resistors; Stock: 209227; Pricing: 1=0.1, 10=0.008, 50=0.008, 100=0.007, 1000=0.006, 10000=0.002 (USD); Case Code (Metric): 1608; Case Code (Imperial): 0603; Contact Material: 152ConductorMaterial; Contact Plating: 157ConductorMaterial; Min Operating Temperature: -55°C; Max Operating Temperature: 155°C; Packaging: Tape and Reel; Number of Terminations: 2; Termination: SMD/SMT; Max Power Dissipation: 100mW; Features: Moisture Resistant; Package Quantity: 1; Resistor Type: Thick Film; Series: RC; Technology: THICK FILM; Length: 0.063inch; Width: 0.031inch; Height: 0.022inch; Depth: 0.8mm; Radiation Hardening: 5898YesNo; Reach SVHC Compliant: No; Lead Free: Lead Free; RoHS Compliant: Yes; ComponentLink1URL: https://datasheet.ciiva.com/11808/0900766b80f96399-11808177.pdf?src-supplier=Rs; ComponentLink1Description: https://datasheet.ciiva.com/11808/0900766b80f96399-11808177.pdf?src-supplier=Rs; ComponentLink2URL: https://datasheet.ciiva.com/7660/1868787-7660793.pdf?src-supplier=Element14; ComponentLink2Description: https://datasheet.ciiva.com/7660/1868787-7660793.pdf?src-supplier=Element14; ComponentLink3URL: https://datasheet.ciiva.com/46440/1868787-46440907.pdf?src-supplier=Element14; ComponentLink3Description: https://datasheet.ciiva.com/46440/1868787-46440907.pdf?src-supplier=Element14; ComponentLink4URL: https://datasheet.ciiva.com/2454/pyu-r-int-thick-7-2454013.pdf?src-supplier=Digikey; ComponentLink4Description: https://datasheet.ciiva.com/2454/pyu-r-int-thick-7-2454013.pdf?src-supplier=Digikey; ComponentLink5URL: https://datasheet.ciiva.com/2454/pyu-r-int-thick-7-2454014.pdf?src-supplier=Digikey; ComponentLink5Description: https://datasheet.ciiva.com/2454/pyu-r-int-thick-7-2454014.pdf?src-supplier=Digikey; ComponentLink6URL: https://datasheet.ciiva.com/2454/pyu-r-int-thick-7-2454012.pdf?src-supplier=Digikey; ComponentLink6Description: https://datasheet.ciiva.com/2454/pyu-r-int-thick-7-2454012.pdf?src-supplier=Digikey; ComponentLink7URL: https://datasheet.ciiva.com/7746/1738695-7746360.pdf?src-supplier=Element14; ComponentLink7Description: https://datasheet.ciiva.com/7746/1738695-7746360.pdf?src-supplier=Element14; ComponentLink8URL: https://datasheet.ciiva.com/7746/1738695-7746359.pdf?src-supplier=Element14; ComponentLink8Description: https://datasheet.ciiva.com/7746/1738695-7746359.pdf?src-supplier=Element14; _Creator: HoP; _SYM_REF: RES_470R_100mW_1%_0603; Case/Package: 0603; Tolerance: 1%
R?#14 R?#16 = Yageo_RC0603FR-071KL: MFG: Yageo; Temperature Coefficient: 100ppm/°C; Power Rating: 100mW; Voltage Rating: 50V; _Checked_PCB: HoP; _Value: 1000; Supplier 1: Mouser; MFG PN: RC0603FR-071KL; RoHS: Yes; Category: Chip SMD Resistors; Stock 1: 9806849; Pricing 1: 1=0.1, 10=0.019, 50=0.019, 100=0.007, 1000=0.004, 10000=0.002 (USD); Contact Plating: Tin,Matte; Case Code (Imperial): 0603; Case Code (Metric): 1608; Size Code: 0603; Min Operating Temperature: -55°C; Max Operating Temperature: 155°C; Resistor Type: Thick Film; Packaging: Tape and Reel; Termination: SMD/SMT; Features: Moisture Resistant; Series: RC; Max Power Dissipation: 100mW; Number of Terminations: 2; Technology: THICK FILM; Resistance Tolerance: 1%; Construction: Rectangular; Length: 1.6mm; Height: 0.45mm; Depth: 0.8mm; Reach SVHC Compliant: No; Lead Free: Lead Free; Military Standard: Not; RoHS Compliant: Yes; Supplier Part Number 1: 603-RC0603FR-071KL; _Checked_SCH: HoP; _Creator: HoP; _SYM_REF: RES_1K_100mW_1%_0603
R?#19 R?#20 = Yageo_RC0603FR-071ML: MFG: Yageo; Voltage Rating: 75V; Power Rating: 100mW; Temperature Coefficient: 100ppm/°C; Application(s): HIGH RELIABILITY; _Checked_PCB: N.A; _Checked_SCH: HoP; _Value: 1000000; Supplier: Mouser; Supplier Part Number: 603-RC0603FR-071ML; MFG PN: RC0603FR-071ML; RoHS: Yes; Category: Chip SMD Resistors; Stock: 529529; Pricing: 1=0.1, 10=0.012, 50=0.012, 100=0.007, 1000=0.005, 10000=0.003 (USD); Case Code (Metric): 1608; Weight: 0.000847oz; Min Operating Temperature: -55°C; Max Operating Temperature: 155°C; Packaging: Cut Tape; Package Quantity: 5000; Termination: SMD/SMT; Type: General Purpose; Series: RC; Technology: THICK FILM; Diameter: 10mm; Length: 1.6mm; Width: 0.8mm; Height: 0.45mm; Lead Pitch: 5mm; Radiation Hardening: 5898YesNo; RoHS Compliant: Yes; Lead Free: 5697LeadFree; ComponentLink1URL: https://datasheet.ciiva.com/11819/0900766b80f96399-11819295.pdf?src-supplier=Rs; ComponentLink1Description: https://datasheet.ciiva.com/11819/0900766b80f96399-11819295.pdf?src-supplier=Rs; ComponentLink2URL: https://datasheet.ciiva.com/7983/443971-7983614.pdf?src-supplier=Element14; ComponentLink2Description: https://datasheet.ciiva.com/7983/443971-7983614.pdf?src-supplier=Element14; ComponentLink3URL: https://datasheet.ciiva.com/12555/rc0603-272842-12555388.pdf?src-supplier=Mouser; ComponentLink3Description: https://datasheet.ciiva.com/12555/rc0603-272842-12555388.pdf?src-supplier=Mouser; _Creator: HoP; _SYM_REF: RES_1M_100mW_1%_0603
U?#1 U?#2 = ST_LM358DT: MFG: STMicroelectronics; Bandwidth: 1.1MHz; Common Mode Rejection Ratio: 60dB; Dual Supply Voltage: 9V; Input Bias Current: 150nA; Input Offset Voltage (Vos): 9mV; Max Dual Supply Voltage: 15V; Max Junction Temperature (Tj): 150°C; Max Output current: 60mA; Max Supply Current: 2mA; Min Dual Supply Voltage: 1.5V; Min Input Voltage: 0V; Min Supply Voltage: 3V; Nominal Supply Current: 350µA; Operating Supply Current: 700µA; Operating Supply Voltage: 5V; Slew Rate: 0.3V/µs; Voltage Gain: 100dB; _Checked_PCB: N.A; _Checked_SCH: HoP; Supplier: DigiKey; Supplier Part Number: 497-1591-1-ND; RoHS: Compliant; Category: Amplifiers - Op Amps, Buffer, Instrumentation; Stock: 70047; Pricing: 1=0.18, 10=0.124, 25=0.1088, 100=0.0925, 250=0.08476, 500=0.0801, 1000=0.07624 (USD); China RoHS: Compliant; Contact Plating: Tin; Gain Bandwidth Product: 1.1MHz; Height: 1.75mm; Height - Seated (Max): 1.75mm; Lead Free: Lead Free; Length: 4.9mm; Lifecycle Status: Production; Max Operating Temperature: 70°C; Min Operating Temperature: 0°C; Mounting Technology: Surface Mount; Number of Amplifiers: 2; Number of Channels: 2; Number of Elements: 2; Pins: 8; Number of Terminals: 8; Output Current: 60mA; Output Current per Channel: 60mA; Packaging: Tape and Reel; Radiation Hardening: No; REACH SVHC: Yes; Schedule B: 8542330000, 8542330000|8542330000|8542330000|8542330000|8542330000|8542330000|8542330000|8542330000|8542330000|8542330000|8542330000|8542330000|8542330000|8542330000|8542330000|8542330000|8542330000|8542330000|8542330000|8542330000|8542330000|8542330000|8542330000|85; Terminal Pitch: 1.27mm; Unity Gain Bandwidth Product: 1.1MHz; Weight: 4.535924g; Width: 3.9mm; ComponentLink1URL: https://datasheet.octopart.com:443/LM358DT-STMicroelectronics-datasheet-116606904.pdf?src-supplier=ODG+(Origin+Data+Global); ComponentLink1Description: https://datasheet.octopart.com:443/LM358DT-STMicroelectronics-datasheet-116606904.pdf?src-supplier=ODG+(Origin+Data+Global); ComponentLink2URL: https://datasheet.octopart.com:443/LM358DT-STMicroelectronics-datasheet-61210252.pdf?src-supplier=element14+APAC; ComponentLink2Description: https://datasheet.octopart.com:443/LM358DT-STMicroelectronics-datasheet-61210252.pdf?src-supplier=element14+APAC; ComponentLink3URL: https://datasheet.octopart.com:443/LM358DT-STMicroelectronics-datasheet-11005313.pdf?src-supplier=STMicroelectronics; ComponentLink3Description: https://datasheet.octopart.com:443/LM358DT-STMicroelectronics-datasheet-11005313.pdf?src-supplier=STMicroelectronics; ComponentLink4URL: https://datasheet.octopart.com:443/LM358DT-STMicroelectronics-datasheet-10410245.pdf?src-supplier=Future+Electronics; ComponentLink4Description: https://datasheet.octopart.com:443/LM358DT-STMicroelectronics-datasheet-10410245.pdf?src-supplier=Future+Electronics; ComponentLink5URL: https://datasheet.octopart.com:443/LM358DT-STMicroelectronics-datasheet-529748.pdf?src-supplier=element14; ComponentLink5Description: https://datasheet.octopart.com:443/LM358DT-STMicroelectronics-datasheet-529748.pdf?src-supplier=element14; ComponentLink6URL: https://datasheet.octopart.com:443/LM358DT-STMicroelectronics-datasheet-109535.pdf?src-supplier=element14; ComponentLink6Description: https://datasheet.octopart.com:443/LM358DT-STMicroelectronics-datasheet-109535.pdf?src-supplier=element14; ComponentLink7URL: https://datasheet.octopart.com:443/LM358DT-STMicroelectronics-datasheet-81668593.pdf?src-supplier=SHENGYU+ELECTRONICS; ComponentLink7Description: https://datasheet.octopart.com:443/LM358DT-STMicroelectronics-datasheet-81668593.pdf?src-supplier=SHENGYU+ELECTRONICS; ComponentLink8URL: https://datasheet.octopart.com:443/LM358DT-STMicroelectronics-datasheet-36993016.pdf?src-supplier=TME; ComponentLink8Description: https://datasheet.octopart.com:443/LM358DT-STMicroelectronics-datasheet-36993016.pdf?src-supplier=TME; ComponentLink9URL: https://datasheet.octopart.com:443/LM358DT-STMicroelectronics-datasheet-57.pdf?src-supplier=Newark; ComponentLink9Description: https://datasheet.octopart.com:443/LM358DT-STMicroelectronics-datasheet-57.pdf?src-supplier=Newark; ComponentLink10URL: https://datasheet.octopart.com:443/LM358DT-STMicroelectronics-datasheet-15994790.pdf?src-supplier=Newark; ComponentLink10Description: https://datasheet.octopart.com:443/LM358DT-STMicroelectronics-datasheet-15994790.pdf?src-supplier=Newark; ComponentLink11URL: https://datasheet.octopart.com:443/LM358DT-STMicroelectronics-datasheet-14137276.pdf?src-supplier=iiiC; ComponentLink11Description: https://datasheet.octopart.com:443/LM358DT-STMicroelectronics-datasheet-14137276.pdf?src-supplier=iiiC; ComponentLink12URL: https://datasheet.octopart.com:443/LM358DT-STMicroelectronics-datasheet-9802834.pdf?src-supplier=RS+(Formerly+Allied+Electronics); ComponentLink12Description: https://datasheet.octopart.com:443/LM358DT-STMicroelectronics-datasheet-9802834.pdf?src-supplier=RS+(Formerly+Allied+Electronics); ComponentLink13URL: https://datasheet.octopart.com:443/LM358DT-STMicroelectronics-datasheet-5352292.pdf?src-supplier=Farnell; ComponentLink13Description: https://datasheet.octopart.com:443/LM358DT-STMicroelectronics-datasheet-5352292.pdf?src-supplier=Farnell; _Creator: HoP; _SYM_REF: OPAMP_2_30V_7mV_1.1MHz_SOIC-8
U?#3-U?#5 = AD_TMP36GT9Z: Manufacturer Lifecycle Status: PRODUCTION; MFG: Analog Devices; Interface: Analog; Min Supply Voltage: 2.7V; Nominal Supply Current: 50µA; Output Voltage: 750mV; _Checked_PCB: N.A; _Checked_SCH: HoP; Supplier: DigiKey; Supplier Part Number: 505-TMP36GT9Z-ND; RoHS: Compliant; Stock: 21790; Pricing: 1=1.65, 5=1.46, 10=1.391, 25=1.3072, 50=1.2504, 100=1.1983, 500=1.0935, 1000=1.05453, 5000=0.97607 (USD); Height: 5.33mm; Length: 5.21mm; Lifecycle Status: Production; Max Operating Temperature: 125°C; Min Operating Temperature: -40°C; Pins: 3; Operating Supply Current: 50µA; Output Current: 50µA; Output Type: ANALOG; Packaging: Bulk; Quiescent Current: 50µA; Radiation Hardening: No; REACH SVHC: No; Schedule B: 8542390000, 8542390000|8542390000|8542390000|8542390000|8542390000; Width: 4.19mm; ComponentLink1URL: https://datasheet.octopart.com:443/TMP36GT9Z-Analog-Devices-datasheet-22148775.pdf?src-supplier=Newark; ComponentLink1Description: https://datasheet.octopart.com:443/TMP36GT9Z-Analog-Devices-datasheet-22148775.pdf?src-supplier=Newark; ComponentLink2URL: https://datasheet.octopart.com:443/TMP36GT9Z-Analog-Devices-datasheet-5402947.pdf?src-supplier=Newark; ComponentLink2Description: https://datasheet.octopart.com:443/TMP36GT9Z-Analog-Devices-datasheet-5402947.pdf?src-supplier=Newark; ComponentLink3URL: https://datasheet.octopart.com:443/TMP36GT9Z-Analog-Devices-datasheet-43345165.pdf?src-supplier=Newark; ComponentLink3Description: https://datasheet.octopart.com:443/TMP36GT9Z-Analog-Devices-datasheet-43345165.pdf?src-supplier=Newark; ComponentLink4URL: https://octopart.com:443/opatz8j6/c1?t=QhvGf-GkH41ult6F1XMK1uxerrKk8BuHUO3r2gtzH5QYSNByVT8K5oWrKRzllxdChceCi5urev1GttViPQqFGwrnaq0kOPS2uuX4Ib1Et6NIq1yW-vCgJYOYJkznJNQDQmlP33F0S6mDHM9gMbX7W6OXZQObx8LKtavlC3P93rqU78kZG97S179MhR3C3ik8Obn5Q2GGP2B7mXVFeNEIwxI-h55_4OvGbl3J9CkB4zAVt71whUlGlaf6y-gIXQs6NegSBU7CKEhgNjl19MnVbtgg-GJ0l4a2di50lsSUg1BEL2cC&src-supplier=Analog+Devices; ComponentLink4Description: https://octopart.com:443/opatz8j6/c1?t=QhvGf-GkH41ult6F1XMK1uxerrKk8BuHUO3r2gtzH5QYSNByVT8K5oWrKRzllxdChceCi5urev1GttViPQqFGwrnaq0kOPS2uuX4Ib1Et6NIq1yW-vCgJYOYJkznJNQDQmlP33F0S6mDHM9gMbX7W6OXZQObx8LKtavlC3P93rqU78kZG97S179MhR3C3ik8Obn5Q2GGP2B7mXVFeNEIwxI-h55_4OvGbl3J9CkB4zAVt71whUlGlaf6y-gIXQs6NegSBU7CKEhgNjl19MnVbtgg-GJ0l4a2di50lsSUg1BEL2cC&src-supplier=Analog+Devices; ComponentLink5URL: https://datasheet.octopart.com:443/TMP36GT9Z-Analog-Devices-datasheet-10538785.pdf?src-supplier=Upverter; ComponentLink5Description: https://datasheet.octopart.com:443/TMP36GT9Z-Analog-Devices-datasheet-10538785.pdf?src-supplier=Upverter; ComponentLink6URL: https://datasheet.octopart.com:443/TMP36GT9Z-Analog-Devices-datasheet-140566988.pdf?src-supplier=Arrow.cn; ComponentLink6Description: https://datasheet.octopart.com:443/TMP36GT9Z-Analog-Devices-datasheet-140566988.pdf?src-supplier=Arrow.cn; ComponentLink7URL: https://datasheet.octopart.com:443/TMP36GT9Z-Analog-Devices-datasheet-14184915.pdf?src-supplier=iiiC; ComponentLink7Description: https://datasheet.octopart.com:443/TMP36GT9Z-Analog-Devices-datasheet-14184915.pdf?src-supplier=iiiC; ComponentLink8URL: https://datasheet.octopart.com:443/TMP36GT9Z-Analog-Devices-datasheet-10022468.pdf?src-supplier=RS+(Formerly+Allied+Electronics); ComponentLink8Description: https://datasheet.octopart.com:443/TMP36GT9Z-Analog-Devices-datasheet-10022468.pdf?src-supplier=RS+(Formerly+Allied+Electronics); ComponentLink9URL: https://datasheet.octopart.com:443/TMP36GT9Z-Analog-Devices-datasheet-120101.pdf?src-supplier=DigiKey; ComponentLink9Description: https://datasheet.octopart.com:443/TMP36GT9Z-Analog-Devices-datasheet-120101.pdf?src-supplier=DigiKey; ComponentLink10URL: http://sigma.octopart.com:80/conflict_mineral_statement/Analog-Devices-company-33.pdf?src-supplier=Compliance+Statements; ComponentLink10Description: http://sigma.octopart.com:80/conflict_mineral_statement/Analog-Devices-company-33.pdf?src-supplier=Compliance+Statements; ComponentLink11URL: https://octopart.com:443/opatz8j6/c1?t=lHvMVavQfBLhltZiE484gbOSLn0tig4v_PEiASQ58UwKoVJB5pcNXZgmEsQiQ-p02KAbepg0N6oJkenNGfBkrLpOZ3fdBXFJ7sCFe7HaatoZoLCFOSc9ICqSqdwxGr3nQDpqjTnGRMwfc1Jw_knGgSaB7D_U9noFu8imSGzaec062pzDwWFvU4JIjuFlW7ul7e7XCgywmvIYHvuz45ilhvTWyrZueHgGGRoxQpIj51KkcNpfCuktsGmXhHaDmOLIlpvJxvsZtozXO_LdXnVrBUbt_-pBH6HoyYlF00hQqH8kzUTz&src-supplier=Compliance+Statements; ComponentLink11Description: https://octopart.com:443/opatz8j6/c1?t=lHvMVavQfBLhltZiE484gbOSLn0tig4v_PEiASQ58UwKoVJB5pcNXZgmEsQiQ-p02KAbepg0N6oJkenNGfBkrLpOZ3fdBXFJ7sCFe7HaatoZoLCFOSc9ICqSqdwxGr3nQDpqjTnGRMwfc1Jw_knGgSaB7D_U9noFu8imSGzaec062pzDwWFvU4JIjuFlW7ul7e7XCgywmvIYHvuz45ilhvTWyrZueHgGGRoxQpIj51KkcNpfCuktsGmXhHaDmOLIlpvJxvsZtozXO_LdXnVrBUbt_-pBH6HoyYlF00hQqH8kzUTz&src-supplier=Compliance+Statements; _Creator: HoP; _SYM_REF: XDCR_Temp_(-40)-125C_2.7-5.5V_TO-92; Category: Temperature and Humidity Sensors